# Altium schematic sheet Power_Management.SchDoc
size A3; Date: 29/01/2025; Engineer: Emirhan BOZKURT; SheetNumber: 3; SheetTotal: 5; PageSize: A3; Position: R&D Electronics Engineer
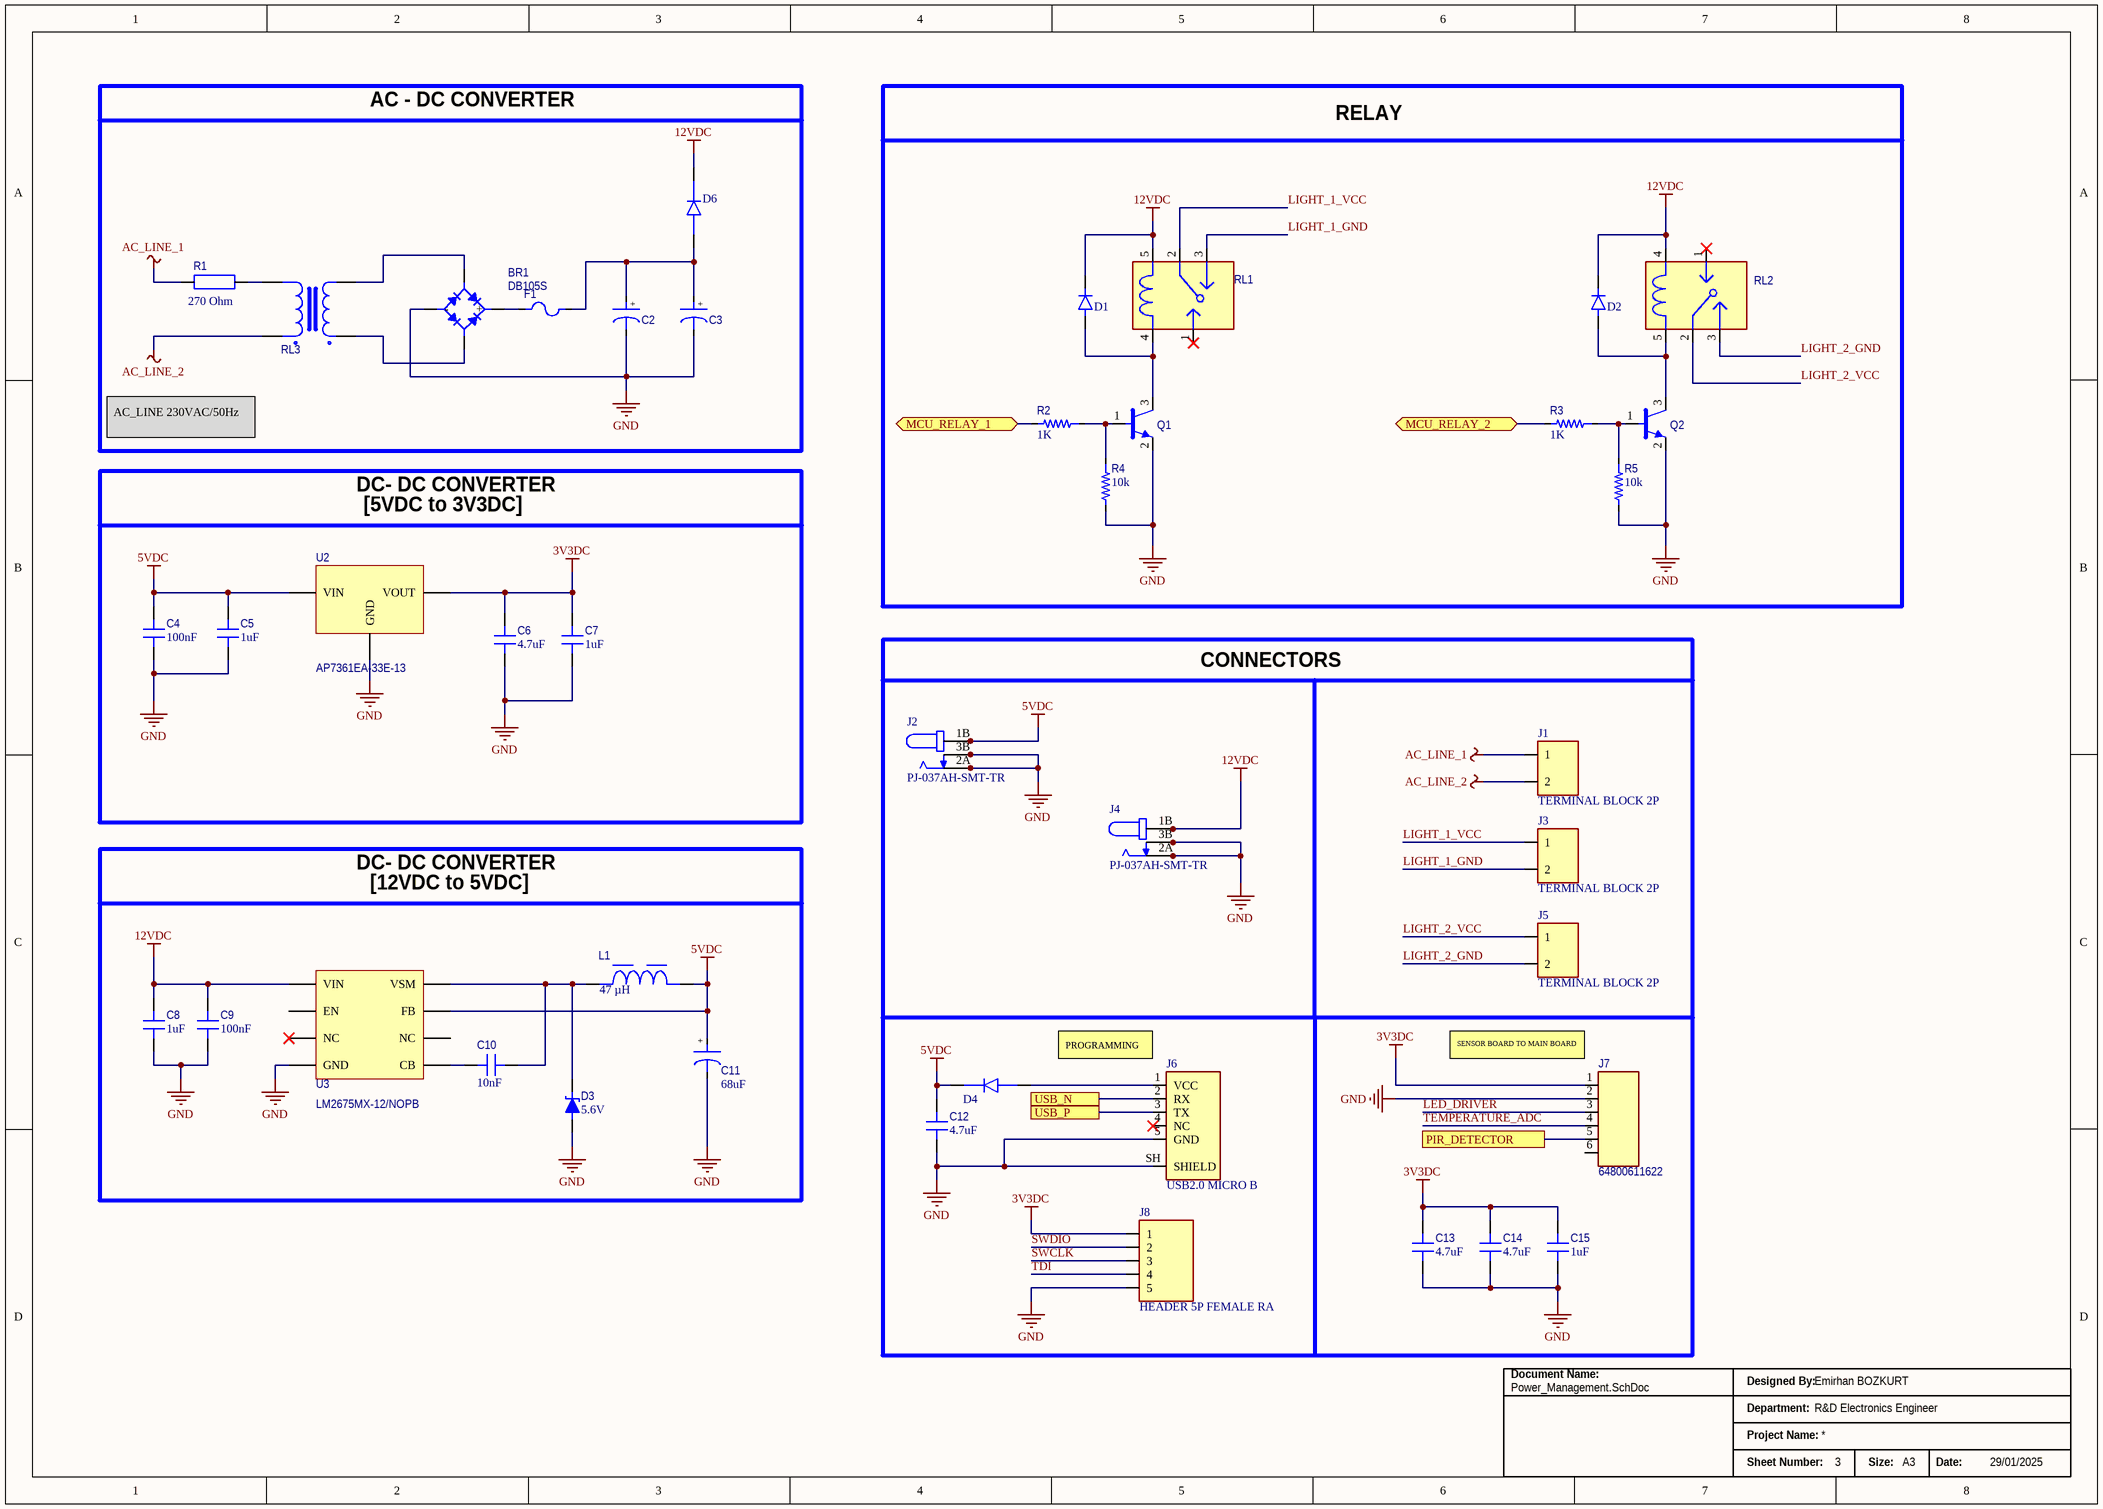
[diagram p0: Power_Management.SchDoc]

## Parts
BR1  DB105S  [DB105S]
C2  ESH477M035AH3AA  [ESH477M035AH3AA]  (value not drawn)
C3  ESH477M035AH3AA  [ESH477M035AH3AA]  (value not drawn)
C4  value 100nF  [CAP_0805]  (hidden comment: 1276-1003-2-ND)
C5  value 1uF  [CAP_0805]  (hidden comment: CL21B105KBFNNNE)
C6  value 4.7uF  [CAP_0805]  (hidden comment: CL21A475KAQNNNE)
C7  value 1uF  [CAP_0805]  (hidden comment: CL21B105KBFNNNE)
C8  value 1uF  [CAP_0805]  (hidden comment: CL21B105KBFNNNE)
C9  value 100nF  [CAP_0805]  (hidden comment: 1276-1003-2-ND)
C10  value 10nF  [CAP_0603]  (hidden comment: CL10B102KB8NNNC)
C11  value 68uF  [CAP_ALU_68uF]  (hidden comment: EEV686M035A9HAA)
C12  value 4.7uF  [CAP_0805]  (hidden comment: CL21A475KAQNNNE)
C13  value 4.7uF  [CAP_0805]  (hidden comment: CL21A475KAQNNNE)
C14  value 4.7uF  [CAP_0805]  (hidden comment: CL21A475KAQNNNE)
C15  value 1uF  [CAP_0805]  (hidden comment: CL21B105KBFNNNE)
D1  1N4148WS  [1N4148WS]  (value not drawn)
D2  1N4148WS  [1N4148WS]  (value not drawn)
D3  value 5.6V  [1SMB5919BT3G]  (hidden comment: 1SMB5919BT3G)
D4  1N4148WS  [1N4148WS]  (value not drawn)
D6  1N4148WS  [1N4148WS]  (value not drawn)
F1  3413.0216.22  [FUSE 1A]  (value not drawn)
J1  TERMINAL BLOCK 2P  [TBP01R1-508]
J2  PJ-037AH-SMT-TR  [PJ-037AH-SMT-TR]
J3  TERMINAL BLOCK 2P  [TBP01R1-508]
J4  PJ-037AH-SMT-TR  [PJ-037AH-SMT-TR]
J5  TERMINAL BLOCK 2P  [TBP01R1-508]
J6  USB2.0 MICRO B  [USB2.0 MICRO B]
J7  64800611622  [64800611622]
J8  HEADER 5P FEMALE RA  [HDR_5_POS_CONN_RA]
L1  value 47 µH  [INT_47uL]  (hidden comment: 78438335470)
Q1  MMBT3904-7-F  [SOT-23F]  (value not drawn)
Q2  MMBT3904-7-F  [SOT-23F]  (value not drawn)
R1  value 270 Ohm  [RES_AXIAL_W]  (hidden comment: 5WD27)
R2  value 1K  [RES_0603]  (hidden comment: RC0603FR-071KL)
R3  value 1K  [RES_0603]  (hidden comment: RC0603FR-071KL)
R4  value 10k  [RES_0603]  (hidden comment: RC0603FR-0710KL)
R5  value 10k  [RES_0603]  (hidden comment: RC0603FR-0710KL)
RL1  ALQ112  [ALQ112]  (value not drawn)
RL2  ALQ112  [ALQ112]  (value not drawn)
RL3  BV302S12010  [BV302S12010]  (value not drawn)
U2  AP7361EA-33E-13  [AP7361EA-33E-13]
U3  LM2675MX-12/NOPB  [LM2675MX-12/NOPB]

## Blocks framed on the sheet
AC - DC CONVERTER: BR1 C2 C3 D6 F1 R1 RL3
RELAY: D1 D2 Q1 Q2 R2-R5 RL1 RL2
CONNECTORS: C12-C15 D4 J1-J8

## Ports
MCU_RELAY_1 (bidir), MCU_RELAY_2 (bidir), PIR_DETECTOR, USB_N, USB_P

## Nets
3V3DC: C6.2 C7.2 C13.2 C14.2 C15.2 J7.1 J8.1 U2.3(VOUT)
5VDC: C4.2 C5.2 C11.1(A) C12.2 D4.C J2.1A J2.1B L1.2 U2.1(VIN) U3.4(FB)
12VDC: C8.2 C9.2 D1.C D2.C D6.C J4.1A J4.1B RL1.5 RL2.4 U3.7(VIN)
AC_LINE_1: J1.1 R1.1
AC_LINE_2: J1.2 RL3.1
GND: BR1.4(-) C2.2(K) C3.2(K) C4.1 C5.1 C6.1 C7.1 C8.1 C9.1 C11.2(K) C12.1 C13.1 C14.1 C15.1 D3.1 J2.2A J2.2B J2.3A J2.3B J4.2A J4.2B J4.3A J4.3B J6.5(GND) J6.SH(SHIELD) J7.2 J8.5 Q1.2(E) Q2.2(E) R4.1 R5.1 U2.2(GND) U3.6(GND)
LED_DRIVER: J7.3
LIGHT_1_GND: J3.2 RL1.3(NO)
LIGHT_1_VCC: J3.1 RL1.2(NC)
LIGHT_2_GND: J5.2 RL2.3(NO)
LIGHT_2_VCC: J5.1 RL2.2(NC)
MCU_RELAY_1: R2.1 ; port MCU_RELAY_1
MCU_RELAY_2: R3.1 ; port MCU_RELAY_2
PIR_DETECTOR: J7.5 ; port PIR_DETECTOR
SWCLK: J8.3
SWDIO: J8.2
TDI: J8.4
TEMPERATURE_ADC: J7.4
USB_N: J6.2(RX) ; port USB_N
USB_P: J6.3(TX) ; port USB_P
NetBR1_1: BR1.1 RL3.9
NetBR1_2: BR1.2 RL3.7
NetBR1_3: BR1.3(+) F1.1
NetC2_1: C2.1(A) C3.1(A) D6.A F1.2
NetC10_1: C10.1 U3.1(CB)
NetC10_2: C10.2 D3.2 L1.1 U3.8(VSM)
NetD1_A: D1.A Q1.3(C) RL1.4
NetD2_A: D2.A Q2.3(C) RL2.5
NetD4_A: D4.A J6.1(VCC)
NetQ1_1: Q1.1(B) R2.2 R4.2
NetQ2_1: Q2.1(B) R3.2 R5.2
NetR1_2: R1.2 RL3.5

Not connected (* = marked no-connect by the designer): J6 4(NC)*; J7 6; RL1 1(COM)*; RL2 1(COM)*; U3 2(NC)* 3(NC) 5(EN)

## Notes on the sheet
- AC_LINE 230VAC/50Hz
- DC- DC CONVERTER
- [5VDC to 3V3DC]
- 5VDC OUTPUT
- AC INPUT CONNECTOR
- 12VDC OUTPUT
- [12VDC to 5VDC]
- (near J3) LED 1 OUTPUT
- (near J5) LED 2 OUTPUT
- PROGRAMMING
- (near J7) SENSOR BOARD TO MAIN BOARD
- Document Name:
- Designed By:
- Department:
- Project Name:
- Sheet Number:
- Size:
- Date:
- (in symbol CAP ALU 68uF SMD) +
- (in symbol CAP ALU 470uF TH) +

## Library data of the parts
BR1 = DB105S: BRIDGE RECT 1PHASE 600V 1A DB-S; Designed By: Emirhan Bozkurt; Supplier Part Number: 1655-DB105STR-ND; Supplier 1: DigiKey; Max Supply Voltage: 600V; Current: 1A; Mounting Type: Surface Mount; Case Package: DB-S
C2 C3 = CAP ALU 470uF TH: CAP ALUM 470UF 20% 35V RADIAL TH; Manufacturer: KEMET; Manufacturer Product Number: ALA7DA471CF450; Designed By: Emirhan Bozkurt; Value: 470uF; Supplier Part Number: 399-6592-ND; Supplier 1: DigiKey; Category: Aluminum Electrolytic Capacitors; Mounting Type: TH; Size: 10mm
C4 C9 = CAP CER 100nF 0805: CAP CER 0.1uF 50V X7R 0805; Designed By: Emirhan Bozkurt; Supplier Part Number: 1276-1003-2-ND; Supplier 1: DigiKey; Case Package: 0805; Mounting Type: Surface Mount; Manufacturer Product Number: 1276-1003-2-ND
C5 C7 C8 C15 = CAP CER 1uF 0805: CAP CER 1uF 25V X5R 0805; Manufacturer: Samsung Electro-Mechanics; Designed By: Emirhan Bozkurt; Supplier Part Number: 1276-1029-1-ND; Supplier 1: DigiKey; Case Package: 0805; Mounting Type: Surface Mount
  C15: Manufacturer Product Number: CL21B105KBFNNNE
C6 C12-C14 = CAP CER 4.7uF 0805: CAP CER 4.7uF 25V X5R 0805; Manufacturer: Samsung Electro-Mechanics; Designed By: Emirhan Bozkurt; Supplier Part Number: CL21A475KAQNNNE; Supplier 1: DigiKey; Case Package: 0805; Mounting Type: Surface Mount; Manufacturer Product Number: CL21A475KAQNNNE
C10 = CAP CER 10nF 0603: CAP CER 1000pF 50V X7R 0603; Manufacturer: Samsung Electro-Mechanics; Designed By: Emirhan Bozkurt; Supplier Part Number: 1276-1018-1-ND; Supplier 1: DigiKey; Case Package: 0603; Mounting Type: Surface Mount
C11 = CAP ALU 68uF SMD: CAP ALUM 68uF 20% 35V SMD; Manufacturer: KEMET; Designed By: Emirhan Bozkurt; Supplier Part Number: 399-6722-1-ND; Supplier 1: DigiKey; Case Package: 0603; Category: Aluminum Electrolytic Capacitors; Mounting Type: Surface Mount
D1 D2 D4 D6 = 1N4148WS: DIODE STANDARD 75V 150MA SOD323F; Manufacturer: Diotec Semiconductor; Designed By: Emirhan Bozkurt; Supplier 1: DigiKey; Case Package: SOD-323F Diotec; Value: *; Supplier Part Number: 1N4148WSFSTR-ND; Check_prices: https://www.snapeda.com/parts/1N4148WS/Diotec/view-part/?ref=eda; Manufacturer Product Number: 1N4148WS
D3 = 1SMB5919BT3G: DIODE ZENER 5.6V 3W SMB; Manufacturer: Onsemi; Supplier Part Number: 1SMB5919BT3GOSCT-ND; Supplier 1: DigiKey; Mounting Type: Surface Mount; Case Package: SMB
F1 = FUSE 1A: FUSE BRD MNT 1A 32VAC 63VDC 1206; Voltage DC: 63V; Designed By: Emirhan Bozkurt; Supplier Part Number: 486-1144-2-ND; Supplier 1: Digi Key; Mounting Type: Surface Mount; Current: 1A
J1 J3 J5 = TERMINAL BLOCK 2P: Designed By: Emirhan Bozkurt; Number of Positions: 2; Mounting Type: Surface Mount, Right Angle; Through Hole; Manufacturer Product Number: *
J2 J4 = PJ-037AH-SMT-TR_1: CONN PWR JACK 2X5.5MM SOLDER; Manufacturer: Same Sky; Designed By: Emirhan Bozkurt; Supply Voltage: 24VDC; Supplier 1: DigiKey; Supplier Part Number: PJ-037AH-SMT-TR; Mounting Type: Surface Mount, Right Angle; Through Hole; Manufacturer Product Number: PJ-037AH-SMT-TR
J6 = USB2.0 MICRO B: CONN RCPT USB2.0 MICRO B SMD R/A; Manufacturer: Amphenol ICC; Manufacturer Product Number: 10118192-0001LF; Designed By: Emirhan Bozkurt; Connector Type: USB - micro B; Supplier Part Number: 609-4613-2-ND; Mounting Type: Surface Mount, Right Angle; Supplier 1: DigiKey
J7 = 64800611622-CONN-6P: WR-WTB WIRE-TO-BOARD CONNECTORS; Manufacturer: WE; Manufacturer Product Number: 1SMB5919BT3G; Pitch: 1.5 mm; Number of Positions: 6; Designed By: Emirhan Bozkurt; Supplier Part Number: 732-64800611622-ND; Supplier 1: DigiKey; Contact Type: Male
J8 = HEADER 5P FEMALE RA: CONN RCPT 5POS 0.1 GOLD SMD R/A; Manufacturer: Samtec; Manufacturer Product Number: SMH-105-02-L-S; Number of Positions: 5; Supplier 1: DigiKey; Supplier Part Number: SMH-105-02-L-S; Package: None
L1 = INT 47uH: FIXED IND 47UH 390MA 2.3 OHM SMD; Supply  Part Number: 732-6947-2-ND; Manufacturer: Würth; Designed By: Emirhan Bozkurt; Supplier 1: DigiKey
Q1 Q2 = MMBT3904-7-F: TRANS NPN 40V 0.2A SOT-23-3; Parameter 1: Surface Mount; Supplier Part Number: MMBT3904-FDICT-ND; Supplier 1: DigiKey; ComponentLink1Description: Datasheet; ComponentLink1URL: https://www.digikey.com/en/products/detail/toshiba-semiconductor-and-storage/SSM3K357R-LF/8611159; FET Type: NPN; Voltage - Collector Emitter: 40V; Case Package: SOT-23-3
R1 = 5WD27: RES WIREWOUND 270 Ohm; Max Power: 5 W; Supplier Part Number: 5WD27; Supplier 1: NTE Electronics; Mounting Type: TH
R2 R3 = RES 1K 0603: RES 1K 1% 1/10W 0603; Suppier Part Number: 311-1.00KHRCT-ND; Manufacturer: YAGEO; Designed By: Emirhan Bozkurt; Supplier 1: DigiKey; Case Package: 0603; Mounting Type: Surface Mount; Category: Chip Resistor; Manufacturer Product Number: RC0603FR-071KL
R4 R5 = RES 10K 0603: RES 10K OHM 1% 1/10W 0603; Suppier Part Number: 311-10.0KHRTR-ND; Manufacturer: YAGEO; Designed By: Emirhan Bozkurt; Supplier 1: DigiKey; Case Package: 0603; Mounting Type: Surface Mount; Category: Chip Resistor; Manufacturer Product Number: RC0603FR-0710KL
RL1 RL2 = ALQ112: RELAY GEN PURPOSE SPDT 10A 12V; Max Switching Voltage: 250V AC - 30V DC; Designed By: Emirhan Bozkurt; Supplier Part Number: 255-3562-ND; Supplier 1: DigiKey; Current: 10A; Mounting Type: TH; Manufacturer Product Number: ALQ112
RL3 = BV302S12010: 230V - 12V PWR XFMR 1VA TH; Designed By: Emirhan Bozkurt; Supplier Part Number: PWR XFMR 1VA TH; Supplier 1: DigiKey; Primary Voltage: 230V; Secondary Voltage: 12V; Operating Frequency: *; Mounting Type: TH
U2 = AP7361EA-33E-13: LDO CMOS HICURR SOT223 T&R 2.5K; Designed By: Emirhan Bozkurt; Max Input Voltage: 6V; Output Voltage: 3.3V; Current: 1A; Supplier Part Number: 31-AP7361EA-33E-13TR-ND; Supplier 1: DigiKey; Mounting Type: Surface Mount; Case Package: SOT223; Manufacturer Product Number: AP7361EA-33E-13
U3 = LM2675MX-12/NOPB: IC REG BUCK 12V 1A SOIC-8; Designed By: Emirhan Bozkurt; Max Input Voltage: 40V; Min Input Voltage: 6.5V; Supplier Part Number: 296-35410-2-ND; Supplier 1: DigiKey; Current: 1A; Mounting Type: Surface Mount; Case Package: SOIC-8